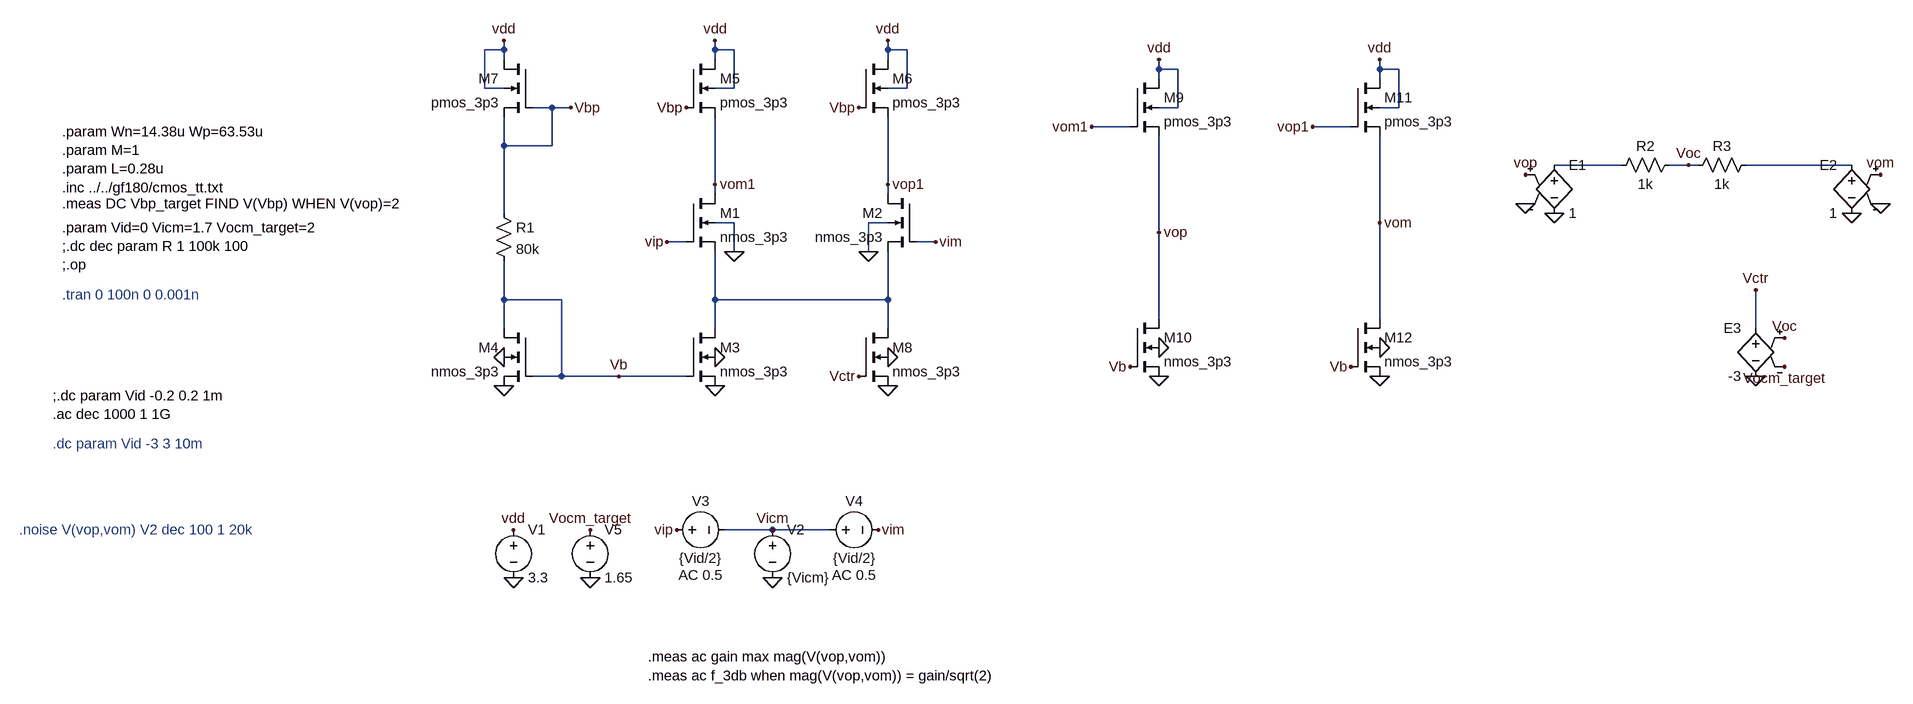
[diagram p0: schematic Draft3.asc]
Draft3.asc, the LTspice schematic file:
Version 4
SHEET 1 2516 1116
WIRE -352 -336 -352 -352
WIRE -352 -336 -384 -336
WIRE 0 -336 0 -352
WIRE 32 -336 0 -336
WIRE 288 -336 288 -352
WIRE 320 -336 288 -336
WIRE -352 -320 -352 -336
WIRE 0 -320 0 -336
WIRE 288 -320 288 -336
WIRE 880 -304 880 -320
WIRE 912 -304 880 -304
WIRE 1248 -304 1248 -320
WIRE 1280 -304 1248 -304
WIRE 880 -288 880 -304
WIRE 1248 -288 1248 -304
WIRE -384 -272 -384 -336
WIRE -352 -272 -384 -272
WIRE 32 -272 32 -336
WIRE 32 -272 0 -272
WIRE 320 -272 320 -336
WIRE 320 -272 288 -272
WIRE -272 -240 -304 -240
WIRE -240 -240 -272 -240
WIRE 912 -240 912 -304
WIRE 912 -240 880 -240
WIRE 1280 -240 1280 -304
WIRE 1280 -240 1248 -240
WIRE 832 -208 768 -208
WIRE 1200 -208 1136 -208
WIRE -352 -176 -352 -224
WIRE -272 -176 -272 -240
WIRE -272 -176 -352 -176
WIRE 2016 -144 1904 -144
WIRE 2128 -144 2096 -144
WIRE 2144 -144 2128 -144
WIRE 2400 -144 2224 -144
WIRE 0 -112 0 -224
WIRE 288 -112 288 -224
WIRE 0 -96 0 -112
WIRE 288 -96 288 -112
WIRE -352 -64 -352 -176
WIRE 32 -48 0 -48
WIRE 288 -48 256 -48
WIRE 1248 -48 1248 -192
WIRE 880 -32 880 -192
WIRE -48 -16 -80 -16
WIRE 368 -16 336 -16
WIRE 32 0 32 -48
WIRE 256 0 256 -48
WIRE -352 80 -352 16
WIRE -256 80 -352 80
WIRE 0 80 0 0
WIRE 288 80 288 0
WIRE 288 80 0 80
WIRE 880 112 880 -32
WIRE 1248 112 1248 -48
WIRE -352 128 -352 80
WIRE 0 128 0 80
WIRE 288 128 288 80
WIRE 2240 128 2240 64
WIRE -256 208 -256 80
WIRE -256 208 -304 208
WIRE -160 208 -256 208
WIRE -48 208 -160 208
WIRE 96 464 16 464
WIRE 192 464 96 464
FLAG 32 0 0
FLAG 0 -352 vdd
FLAG -336 464 vdd
FLAG -336 544 0
FLAG 256 0 0
FLAG 288 -352 vdd
FLAG 0 224 0
FLAG 0 176 0
FLAG -352 176 0
FLAG -352 224 0
FLAG 96 544 0
FLAG -64 464 vip
FLAG 272 464 vim
FLAG -80 -16 vip
FLAG 368 -16 vim
FLAG 0 -112 vom1
FLAG 288 -112 vop1
FLAG -48 -240 Vbp
FLAG 240 -240 Vbp
FLAG 96 464 Vicm
FLAG -352 -352 vdd
FLAG -240 -240 Vbp
FLAG 1856 -128 vop
FLAG 1904 -64 0
FLAG 1856 -80 0
FLAG 2448 -128 vom
FLAG 2400 -64 0
FLAG 2448 -80 0
FLAG 2128 -144 Voc
FLAG 2288 144 Voc
FLAG 2288 192 Vocm_target
FLAG 2240 208 0
FLAG 2240 64 Vctr
FLAG -208 544 0
FLAG -208 464 Vocm_target
FLAG 288 224 0
FLAG 288 176 0
FLAG 240 208 Vctr
FLAG 880 -320 vdd
FLAG 880 208 0
FLAG 880 160 0
FLAG 768 -208 vom1
FLAG 1248 -320 vdd
FLAG 1248 208 0
FLAG 1248 160 0
FLAG 1136 -208 vop1
FLAG 880 -32 vop
FLAG 1248 -48 vom
FLAG -160 208 Vb
FLAG 832 192 Vb
FLAG 1200 192 Vb
SYMBOL nmos4 -48 -96 R0
SYMATTR InstName M1
SYMATTR Value nmos_3p3
SYMATTR Value2 l='L' w='Wn/10' m=5
SYMBOL voltage -336 448 R0
WINDOW 123 0 0 Left 0
WINDOW 39 0 0 Left 0
SYMATTR InstName V1
SYMATTR Value 3.3
SYMBOL nmos4 336 -96 M0
SYMATTR InstName M2
SYMATTR Value nmos_3p3
SYMATTR Value2 l='L' w='Wn/10' m=5
SYMBOL nmos4 -48 128 R0
SYMATTR InstName M3
SYMATTR Value nmos_3p3
SYMATTR Value2 l='L' w='Wn/10' m=7
SYMBOL nmos4 -304 128 M0
SYMATTR InstName M4
SYMATTR Value nmos_3p3
SYMATTR Value2 l='L' w='Wn/10' m='M'
SYMBOL voltage 96 448 R0
WINDOW 123 0 0 Left 0
WINDOW 39 0 0 Left 0
SYMATTR InstName V2
SYMATTR Value {Vicm}
SYMBOL voltage -80 464 R270
WINDOW 0 32 56 VTop 2
WINDOW 3 -32 56 VBottom 2
WINDOW 123 -60 56 VBottom 2
WINDOW 39 0 0 Left 0
SYMATTR InstName V3
SYMATTR Value {Vid/2}
SYMATTR Value2 AC 0.5
SYMBOL voltage 176 464 R270
WINDOW 0 32 56 VTop 2
WINDOW 3 -32 56 VBottom 2
WINDOW 123 -60 56 VBottom 2
WINDOW 39 0 0 Left 0
SYMATTR InstName V4
SYMATTR Value {Vid/2}
SYMATTR Value2 AC 0.5
SYMBOL nmos4 -48 -320 R0
SYMATTR InstName M5
SYMATTR Value pmos_3p3
SYMATTR Value2 l='L' w='Wp/5' m=5
SYMBOL nmos4 240 -320 R0
SYMATTR InstName M6
SYMATTR Value pmos_3p3
SYMATTR Value2 l='L' w='Wp/5' m=5
SYMBOL res -368 -80 R0
SYMATTR InstName R1
SYMATTR Value 80k
SYMBOL nmos4 -304 -320 M0
SYMATTR InstName M7
SYMATTR Value pmos_3p3
SYMATTR Value2 l='L' w='Wp/5' m='M'
SYMBOL res 2112 -160 R90
WINDOW 0 0 56 VBottom 2
WINDOW 3 32 56 VTop 2
SYMATTR InstName R2
SYMATTR Value 1k
SYMBOL res 2240 -160 R90
WINDOW 0 0 56 VBottom 2
WINDOW 3 32 56 VTop 2
SYMATTR InstName R3
SYMATTR Value 1k
SYMBOL e 1904 -160 R0
SYMATTR InstName E1
SYMATTR Value 1
SYMBOL e 2400 -160 M0
SYMATTR InstName E2
SYMATTR Value 1
SYMBOL e 2240 112 M0
SYMATTR InstName E3
SYMATTR Value -3
SYMBOL voltage -208 448 R0
WINDOW 123 0 0 Left 0
WINDOW 39 0 0 Left 0
SYMATTR InstName V5
SYMATTR Value 1.65
SYMBOL nmos4 240 128 R0
SYMATTR InstName M8
SYMATTR Value nmos_3p3
SYMATTR Value2 l='L' w='Wn/10' m=3
SYMBOL nmos4 832 -288 R0
SYMATTR InstName M9
SYMATTR Value pmos_3p3
SYMATTR Value2 l='L' w='Wp/5' m=5
SYMBOL nmos4 832 112 R0
SYMATTR InstName M10
SYMATTR Value nmos_3p3
SYMATTR Value2 l='L' w='Wn/10' m=5
SYMBOL nmos4 1200 -288 R0
SYMATTR InstName M11
SYMATTR Value pmos_3p3
SYMATTR Value2 l='L' w='Wp/5' m=5
SYMBOL nmos4 1200 112 R0
SYMATTR InstName M12
SYMATTR Value nmos_3p3
SYMATTR Value2 l='L' w='Wn/10' m=5
TEXT -1088 -200 Left 2 !.param Wn=14.38u Wp=63.53u\n.param M=1\n.param L=0.28u\n.inc ../../gf180/cmos_tt.txt
TEXT -1088 -40 Left 2 !.param Vid=0 Vicm=1.7 Vocm_target=2\n;.dc dec param R 1 100k 100\n;.op
TEXT -1088 -80 Left 2 !.meas DC Vbp_target FIND V(Vbp) WHEN V(vop)=2
TEXT -1088 72 Left 2 ;.tran 0 100n 0 0.001n
TEXT -1104 240 Left 2 !;.dc param Vid -0.2 0.2 1m\n.ac dec 1000 1 1G
TEXT -1104 320 Left 2 ;.dc param Vid -3 3 10m
TEXT -1160 464 Left 2 ;.noise V(vop,vom) V2 dec 100 1 20k
TEXT -112 704 Left 2 !.meas ac gain max mag(V(vop,vom))\n.meas ac f_3db when mag(V(vop,vom)) = gain/sqrt(2)

The netlist it stands for:
* Draft3.asc
M1 vom1 vip N003 0 nmos_3p3 l='L' w='Wn/10' m=5
V1 vdd 0 3.3
M2 vop1 vim N003 0 nmos_3p3 l='L' w='Wn/10' m=5
M3 N003 Vb 0 0 nmos_3p3 l='L' w='Wn/10' m=7
M4 Vb Vb 0 0 nmos_3p3 l='L' w='Wn/10' m='M'
V2 Vicm 0 {Vicm}
V3 vip Vicm {Vid/2} AC 0.5
V4 Vicm vim {Vid/2} AC 0.5
M5 vdd Vbp vom1 vdd pmos_3p3 l='L' w='Wp/5' m=5
M6 vdd Vbp vop1 vdd pmos_3p3 l='L' w='Wp/5' m=5
R1 Vbp Vb 80k
M7 vdd Vbp Vbp vdd pmos_3p3 l='L' w='Wp/5' m='M'
R2 Voc N001 1k
R3 N002 Voc 1k
E1 N001 0 vop 0 1
E2 N002 0 vom 0 1
E3 Vctr 0 Voc Vocm_target -3
V5 Vocm_target 0 1.65
M8 N003 Vctr 0 0 nmos_3p3 l='L' w='Wn/10' m=3
M9 vdd vom1 vop vdd pmos_3p3 l='L' w='Wp/5' m=5
M10 vop Vb 0 0 nmos_3p3 l='L' w='Wn/10' m=5
M11 vdd vop1 vom vdd pmos_3p3 l='L' w='Wp/5' m=5
M12 vom Vb 0 0 nmos_3p3 l='L' w='Wn/10' m=5
.model NMOS NMOS
.model PMOS PMOS
.lib standard.mos
.param Wn=14.38u Wp=63.53u
.param M=1
.param L=0.28u
.inc ../../gf180/cmos_tt.txt
.param Vid=0 Vicm=1.7 Vocm_target=2
;.dc dec param R 1 100k 100
;.op
.meas DC Vbp_target FIND V(Vbp) WHEN V(vop)=2
* .tran 0 100n 0 0.001n
;.dc param Vid -0.2 0.2 1m
.ac dec 1000 1 1G
* .dc param Vid -3 3 10m
* .noise V(vop,vom) V2 dec 100 1 20k
.meas ac gain max mag(V(vop,vom))
.meas ac f_3db when mag(V(vop,vom)) = gain/sqrt(2)
.backanno
.end